# EAGLE design ccnor_stm32_v25-sync-unified-mini (EAGLE 6.1)
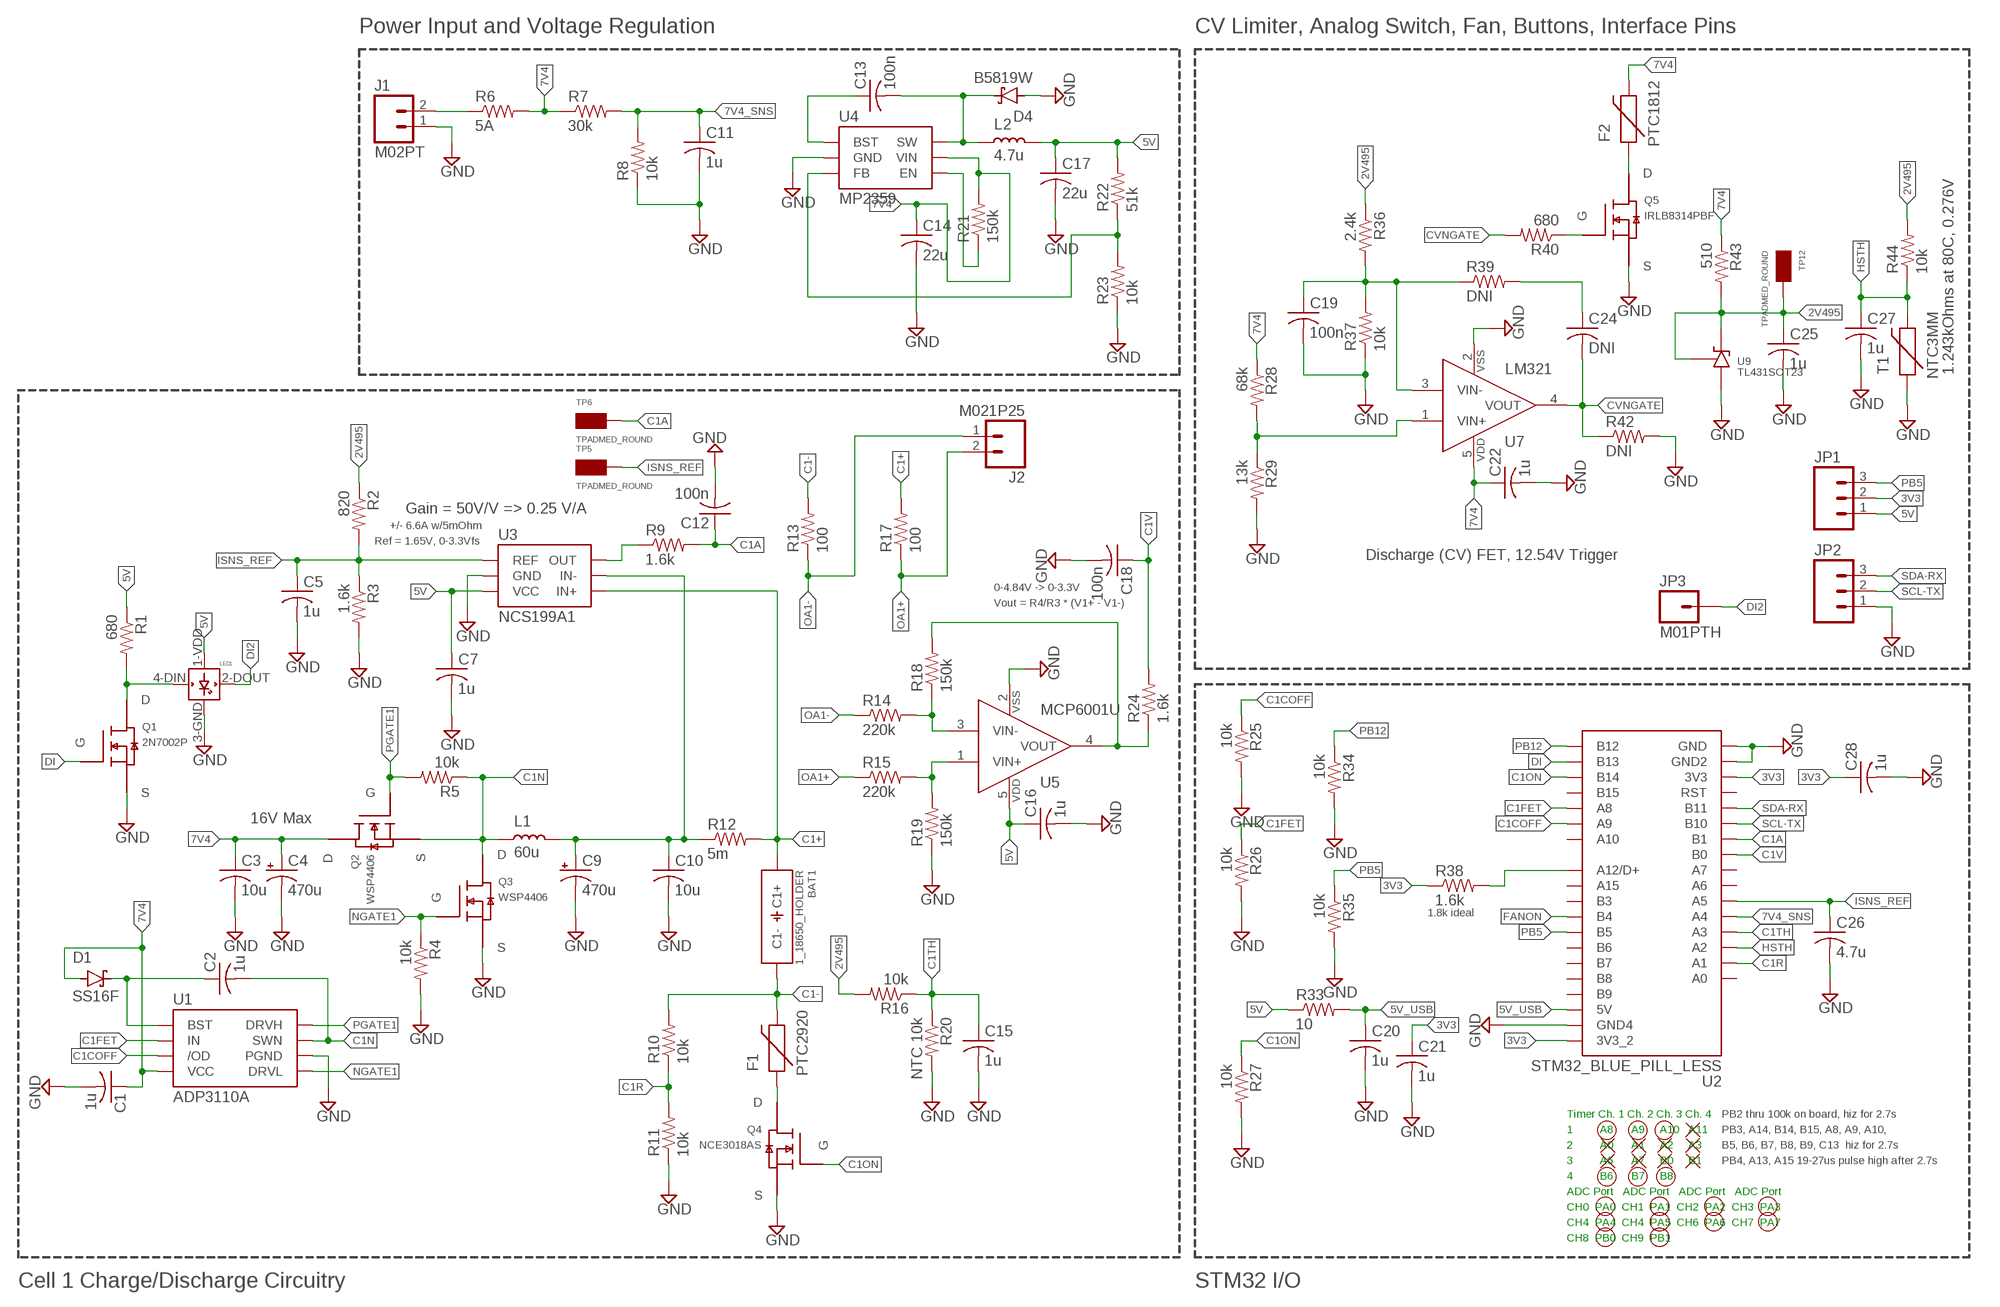
[diagram p0: schematic, sheet 1]

## Parts
BAT1  1_18650_HOLDER  [1S_18650_SMD_NH]
C1  1u  C-USC0402  [C0402]
C2  1u  C-USC0603  [C0603]
C3  10u  C-USC1206  [C1206]
C4  470u  CPOL-USE2.5-7  [E2,5-7]
C5  1u  C-USC0402  [C0402]
C7  1u  C-USC0402  [C0402]
C9  470u  CPOL-USE2.5-7  [E2,5-7]
C10  10u  C-USC1206  [C1206]
C11  1u  C-USC0402  [C0402]
C12  100n  C-USC0402  [C0402]
C13  100n  C-USC0402  [C0402]
C14  22u  C-USC0805  [C0805]
C15  1u  C-USC0402  [C0402]
C16  1u  C-USC0402  [C0402]
C17  22u  C-USC0603  [C0603]
C18  100n  C-USC0402  [C0402]
C19  100n  C-USC0402  [C0402]
C20  1u  C-USC0402  [C0402]
C21  1u  C-USC0402  [C0402]
C22  1u  C-USC0402  [C0402]
C24  DNI  C-USC0402  [C0402]
C25  1u  C-USC0402  [C0402]
C26  4.7u  C-USC0402  [C0402]
C27  1u  C-USC0402  [C0402]
C28  1u  C-USC0402  [C0402]
D1  SS16F  DIODE_SCHOTTKYCDBM140-G  [SOD123]
D4  B5819W  PMEG3020ER  [SOD123W]
F1  PTC2920  [2920]
F2  PTC1812  [1812]
J1  M02PT  [PHOENIXCONTACT1935161]
J2  M021P25  [M02_1P25MM]
JP1  M03PTH  [1X03]
JP2  M03PTH  [1X03]
JP3  M01PTH  [1X01]
L1  60u  INDUCTOR10A  [INDUCTOR_10A_8.2MMX21MM]
L2  4.7u  INDUCTOR0805  [0805]
LED1  WS2812B  [WS2812B]
Q1  2N7002P  [SOT23]
Q2  WSP4406  N-MOSFET-SOIC8  [8-SOIC]
Q3  WSP4406  N-MOSFET-SOIC8  [8-SOIC]
Q4  NCE3018AS  N-MOSFET-SOIC8  [8-SOIC]
Q5  IRLB8314PBF  [TO-220]
R1  680  R-US_R0402  [R0402]
R2  820  R-US_R0402  [R0402]
R3  1.6k  R-US_R0402  [R0402]
R4  10k  R-US_R0402  [R0402]
R5  10k  R-US_R0402  [R0402]
R6  5A  R-US_R1206  [R1206]
R7  30k  R-US_R0402  [R0402]
R8  10k  R-US_R0402  [R0402]
R9  1.6k  R-US_R0402  [R0402]
R10  10k  R-US_R0402  [R0402]
R11  10k  R-US_R0402  [R0402]
R12  5m  R-US_R1206  [R1206]
R13  100  R-US_R0402  [R0402]
R14  220k  R-US_R0402  [R0402]
R15  220k  R-US_R0402  [R0402]
R16  10k  R-US_R0402  [R0402]
R17  100  R-US_R0402  [R0402]
R18  150k  R-US_R0402  [R0402]
R19  150k  R-US_R0402  [R0402]
R20  NTC 10k  R-US_R0402  [R0402]
R21  150k  R-US_R0402  [R0402]
R22  51k  R-US_R0402  [R0402]
R23  10k  R-US_R0402  [R0402]
R24  1.6k  R-US_R0402  [R0402]
R25  10k  R-US_R0402  [R0402]
R26  10k  R-US_R0402  [R0402]
R27  10k  R-US_R0402  [R0402]
R28  68k  R-US_R0402  [R0402]
R29  13k  R-US_R0402  [R0402]
R33  10  R-US_R0402  [R0402]
R34  10k  R-US_R0402  [R0402]
R35  10k  R-US_R0402  [R0402]
R36  2.4k  R-US_R0402  [R0402]
R37  10k  R-US_R0402  [R0402]
R38  1.6k  R-US_R0402  [R0402]
R39  DNI  R-US_R0402  [R0402]
R40  680  R-US_R0402  [R0402]
R42  DNI  R-US_R0402  [R0402]
R43  510  R-US_R0402  [R0402]
R44  10k  R-US_R0402  [R0402]
T1  NTC3MM  PTCNTC3MM  [THERMISTOR_3MMX3MM]
TP5  TPADMED_ROUND  [TPAD_MED_ROUND]
TP6  TPADMED_ROUND  [TPAD_MED_ROUND]
TP12  TPADMED_ROUND  [TPAD_MED_ROUND]
U1  ADP3110A  [8-SOIC]
U2  STM32_BLUE_PILL_LESS  [STM32_BLUE_PILL_SMD]
U3  NCS199A1  INA214  [SOT-363]
U4  MP2359  JW5052C  [SOT23-6]
U5  MCP6001U  [SOT23-5]
U7  LM321  [SOT23-5]
U9  TL431SOT23  [SOT23]

## Nets
2V495: C25.1 R2.1 R16.2 R36.1 R43.2 R44.2 TP12.1 U9.1(K) U9.2(REF)
3V3: C21.1 C28.1 JP1.2 R38.1 U2.3V3 U2.3V3_2
5V: C7.1 C16.1 C17.1 JP1.1 L2.2 LED1.1-VDD(VDD) R1.1 R22.2 R33.1 U3.3(VCC) U5.5(VDD)
5V_USB: C20.1 R33.2 U2.5V
7V4: C1.1 C3.1 C4.+ C14.1 C22.1 D1.A(ANODE) F2.2 Q2.5(D) Q2.6(D) Q2.7(D) Q2.8(D) R6.2 R7.1 R21.2 R28.1 R43.1 U1.4(VCC) U4.5(VIN) U7.5(VDD)
7V4_SNS: C11.1 R7.2 R8.2 U2.A4
BST: C2.1 D1.K(CATHODE) U1.1(BST)
BST5V: C13.1 U4.1(BST)
C1+: BAT1.1+(C1+) R12.2 R17.2 U3.4(IN+)
C1-: BAT1.1-(C1-) F1.K R10.2 R13.2
C1A: C12.1 R9.2 TP6.1 U2.B1
C1COFF: R25.1 U1.3(/OD) U2.A9
C1FET: R26.1 U1.2(IN) U2.A8
C1N: C2.2 L1.P$1 Q2.1(S) Q2.2(S) Q2.3(S) Q3.5(D) Q3.6(D) Q3.7(D) Q3.8(D) R5.1 U1.7(SWN)
C1ON: Q4.4(G) R27.1 U2.B14
C1R: R10.1 R11.2 U2.A1
C1TH: C15.1 R16.1 R20.1 U2.A3
C1V: C18.1 R24.2 U2.B0
C1V_OA: R18.2 R24.1 U5.4(VOUT)
C1VFBN: C24.1 R39.2
CVNGATE: C24.2 R40.2 R42.1 U7.4(VOUT)
CVOAREF: C19.1 R36.2 R37.2 R39.1 U7.3(VIN-)
CVOASNS: R28.2 R29.1 U7.1(VIN+)
DI: Q1.1(G) U2.B13
DI1: LED1.4-DIN(DIN) Q1.3(D) R1.2
DI2: JP3.1 LED1.2-DOUT(DOUT)
EN5V: R21.1 U4.4(EN)
FANON: U2.B4
FB5V: R22.1 R23.2 U4.3(FB)
GND: C1.2 C3.2 C4.- C5.2 C7.2 C9.- C10.2 C11.2 C12.2 C14.2 C15.2 C16.2 C17.2 C18.2 C19.2 C20.2 C21.2 C22.2 C25.2 C26.2 C27.2 C28.2 D4.A(ANODE) J1.1 JP2.1 LED1.3-GND(GND) Q1.2(S) Q3.1(S) Q3.2(S) Q3.3(S) Q4.1(S) Q4.2(S) Q4.3(S) Q5.3(S) R3.2 R4.2 R8.1 R11.1 R19.1 R20.2 R23.1 R25.2 R26.2 R27.2 R29.2 R34.2 R35.2 R37.1 R42.2 T1.1 U1.6(PGND) U2.GND U2.GND2 U2.GND4 U3.2(GND) U4.2(GND) U5.2(VSS) U7.2(VSS) U9.3(A)
HSTH: C27.1 R44.1 T1.2 U2.A2
IN-1: C9.+ C10.1 L1.P$2 R12.1 U3.5(IN-)
IS1O: R9.1 U3.6(OUT)
ISNS_REF: C5.1 C26.1 R2.2 R3.1 TP5.1 U2.A5 U3.1(REF)
N$3: R15.2 R19.2 U5.1(VIN+)
N$4: R14.2 R18.1 U5.3(VIN-)
N$10: F2.1 Q5.2(D)
N$13: J1.2 R6.1
N$26: R38.2 U2.A12(A12/D+)
N$32: F1.A Q4.5(D) Q4.6(D) Q4.7(D) Q4.8(D)
NGATE1: Q3.4(G) R4.1 U1.5(DRVL)
OA1+: J2.2 R15.1 R17.1
OA1-: J2.1 R13.1 R14.1
PB5: JP1.3 R35.1 U2.B5
PB12: R34.1 U2.B12
PGATE1: Q2.4(G) R5.2 U1.8(DRVH)
Q7G: Q5.1(G) R40.1
SCL-TX: JP2.2 U2.B10
SDA-RX: JP2.3 U2.B11
SW5V: C13.2 D4.K(CATHODE) L2.1 U4.6(SW)
Unconnected: U2.A0 U2.A6 U2.A7 U2.A10 U2.A15 U2.B3 U2.B6 U2.B7 U2.B8 U2.B9 U2.B15 U2.RST

## Notes on the sheet
- Power Input and Voltage Regulation | CV Limiter, Analog Switch, Fan, Buttons, Interface Pins
- 1.243kOhms at 80C, 0.276V
- Gain = 50V/V => 0.25 V/A
- +/- 6.6A w/5mOhm
- Ref = 1.65V, 0-3.3Vfs
- Discharge (CV) FET, 12.54V Trigger
- 0-4.84V -> 0-3.3V
- Vout = R4/R3 * (V1+ - V1-)
- 16V Max
- 1.8k ideal
- Timer Ch. 1 Ch. 2 Ch. 3 Ch. 4 | PB2 thru 100k on board, hiz for 2.7s
- 1         A8      A9     A10   A11 | PB3, A14, B14, B15, A8, A9, A10,
- 2         A0      A1     A2     A3 | B5, B6, B7, B8, B9, C13  hiz for 2.7s
- 3         A6      A7     B0     B1 | PB4, A13, A15 19-27us pulse high after 2.7s
- 4         B6      B7     B8
- ADC Port   ADC Port   ADC Port   ADC Port
- CH0  PA0  CH1  PA1  CH2  PA2  CH3  PA3
- CH4  PA4  CH4  PA5  CH6  PA6  CH7  PA7
- CH8  PB0  CH9  PB1
- Cell 1 Charge/Discharge Circuitry | STM32 I/O

## Library data of the parts
BAT1 = custom:1_18650_HOLDER
C1-C3 C5 C7 C10-C22 C24-C28 = resistor:C-US: CAPACITOR, American symbol
C4 C9 = resistor:CPOL-US: POLARIZED CAPACITOR, American symbol
D1 = custom:DIODE_SCHOTTKY: 40V 1A 500mV @1A
D4 = custom:PMEG3020ER: Schottky Diode 30V 2A 0.42V 1.5mA Leakage
F1 F2 T1 = custom:PTC
J1 J2 = custom:M02: 2-pin Header
JP1 JP2 = SparkFun:M03: Header 3 Standard 3-pin 0.1" header. Use with straight break away headers (SKU : PRT-00116), right angle break away headers (PRT-00553), swiss pins (PRT-00743), machine pins (PRT-00117), and female headers (PRT-00115). Molex polarized connector foot print use with SKU : PRT-08232 with associated crimp pins and housings.
JP3 = SparkFun:M01: Header 1 Standard 1-pin 0.1" header. Use with straight break away headers (SKU : PRT-00116), right angle break away headers (PRT-00553), swiss pins (PRT-00743), machine pins (PRT-00117), and female headers (PRT-00115).
L1 L2 = custom:INDUCTOR
LED1 = adafruit:WS2812B
Q1 = custom:2N7002P: 2N7002P N-channel MOSFET 60V 360mA Logic Level
Q2-Q4 = custom:N-MOSFET-SOIC8
Q5 = custom:IRLB8314PBF: MOSFET N-Channel 30V 184A 3.2mOhm @4.5Vgs 125W
R1-R29 R33-R40 R42-R44 = resistor:R-US_: RESISTOR, American symbol
TP5 TP6 TP12 = custom:TPAD
U1 = custom:ADP3110A: MOSFET Driver Dual Bootstrapped 12 V w/Output Disable 3nF 25ns Synchronous
U2 = custom:STM32_BLUE_PILL_LESS
U3 = custom:INA214: Current Shunt Amplifier 30kHz 2.7-26V
U4 = custom:JW5052C: Buck Regulator Synchronous 4.5-18V 2A 700kHz 100uA 120mOhm
U5 = custom:MCP6001: Op-Amp Single Rail-to-Rail 1MHz
U7 = custom:LM321: Op-Amp Low Power Single 3-32V Vcm 0-(Vcc-1.5) Vo 0.02-(Vcc-2)
U9 = custom:TL431: Shunt Voltage Reference IC 700uA 100mA 36V

## Board
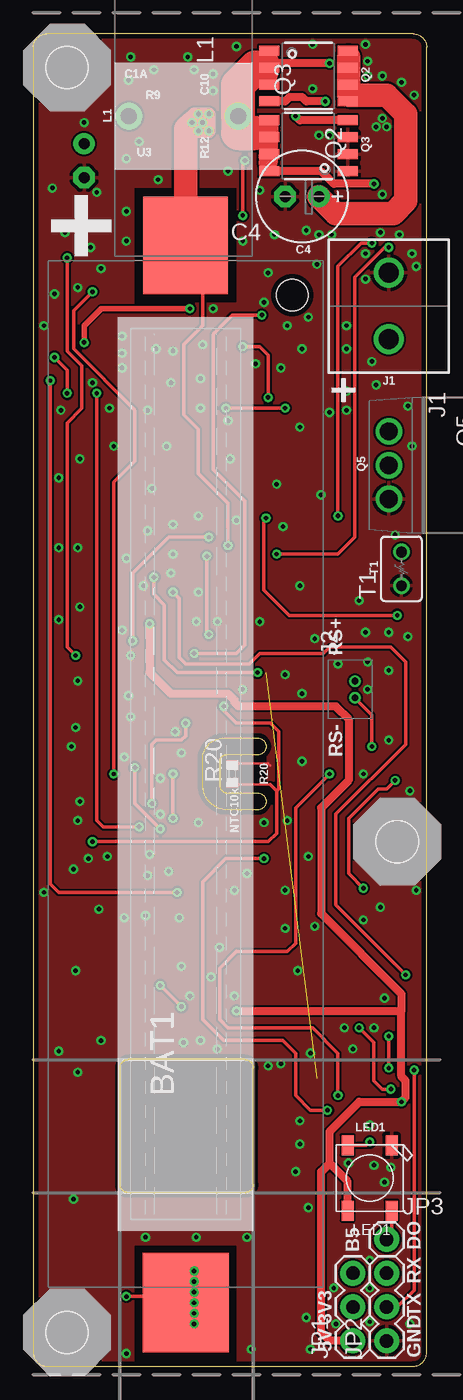
[diagram p1: board, top side]
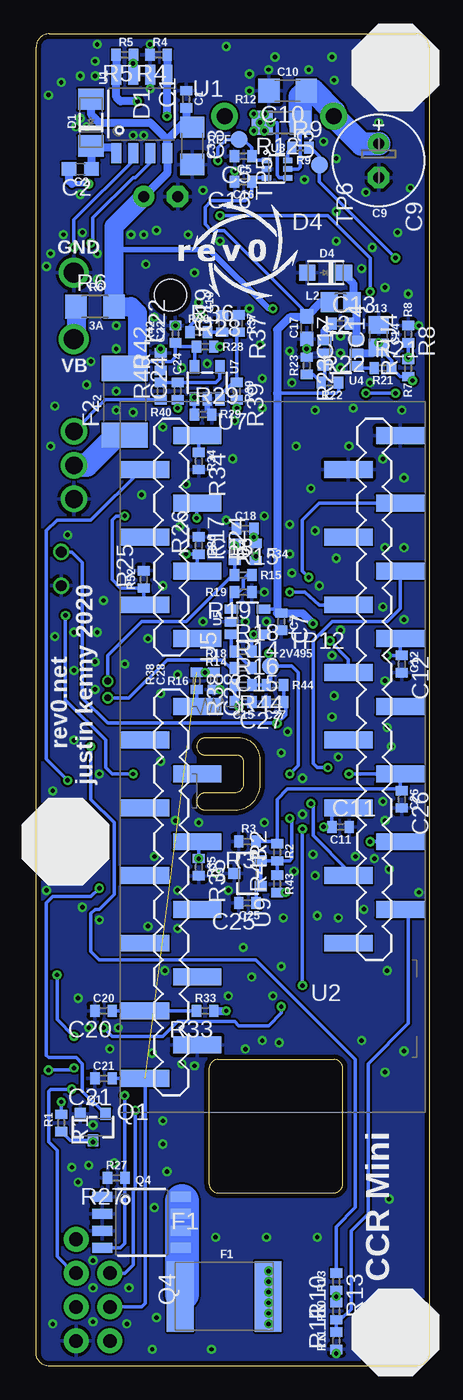
[diagram p2: board, bottom side, seen from below]

Size 29.52 x 100 mm. Coordinates in mm from the lower left corner, seen from the top.
Outline: 1,0 28.52,0 arc90 29.52,1 29.52,99 arc90 28.52,100 1,100 arc90 0,99 0,1 arc90 1,0
Outline: 16.83,45.88 14.45,45.88 arc90 13.97,45.4 13.97,43.66 arc90 14.61,43.02 16.83,43.02 arc-180 16.83,41.75 14.61,41.75 arc-90 12.7,43.66 12.7,45.56 arc-90 14.29,47.15 16.83,47.15 arc-180 16.83,45.88
Outline: 6.51,13.65 6.51,22.38 arc-90 7.14,23.02 15.88,23.02 arc-90 16.51,22.38 16.51,13.65 arc-90 15.88,13.02 7.14,13.02 arc-90 6.51,13.65
Copper layers (1*16): Top 0.0356mm / dielectric 1.5011mm / Bottom 0.0356mm
Design rules: minimum track width 6mil, minimum drill 13mil, track to track 6mil, track to pad 6mil, pad to pad 6mil, via to via 6mil, smd to smd 6mil, copper to edge 15mil, drill to drill 6mil, minimum pad ring 7mil, minimum via ring 7mil, stop-mask expansion 2.5mil, vias tented up to drill 14mil, thermal gap 10mil
Holes 3.17 mm at 2.54,2.54 2.54,97.47 27.3,39.37
tRestrict: area -0.6,94.3 to 5.7,100.6; area -0.6,-0.6 to 5.7,5.7; area 14,43 to 17.5,45.7; area 7.6,0.5 to 15.2,9; area 7.6,79.9 to 15.2,88.4; area 24.1,36.2 to 30.5,42.5
bRestrict: area 14,42.5 to 17.5,46.4; area -0.6,-0.6 to 5.7,5.7; area -0.6,94.3 to 5.7,100.6; area 24.1,36.2 to 30.5,42.5

### Footprints (pad centres in the part's own frame; a part is rotated, then mirrored left to right if it is on the bottom)
1S_18650_SMD_NH = smd 7.341 x 6.35: 1+ 39.67,0 | smd 7.46 x 6.47: 1- -39.67,0 | hole 2.39: 35.93,-8
C0402 = smd 0.7 x 0.9: 1 -0.65,0; 2 0.65,0
C0603 = smd 1.1 x 1: 1 -0.85,0; 2 0.85,0
C1206 = smd 1.6 x 1.8: 1 -1.4,0; 2 1.4,0
E2,5-7 = drill 0.813 pad 1.6: + -1.27,0 | drill 0.813 pad 1.6 octagon: - 1.27,0
C0805 = smd 1.3 x 1.5: 1 -0.85,0; 2 0.85,0
SOD123 = smd 1.6 x 1.9: A -1.75,0; K 1.75,0
SOD123W = smd 1.2 x 1.2: A -1.4,0; K 1.4,0
2920 = smd 2 x 5.3: A -3.3,0; K 3.3,0
1812 = smd 1.9 x 3.45: 1 -2.5,0; 2 2.5,0
PHOENIXCONTACT1935161 = drill 1.5: 1 0,0; 2 5,0
M02_1P25MM = drill 0.5: 1 -0.625,0; 2 0.625,0
1X03 = drill 1.016 pad 1.88: 1 0,0; 2 2.54,0; 3 5.08,0
1X01 = drill 1.016 pad 1.88: 1 0,0
INDUCTOR_10A_8.2MMX21MM = drill 1.2 pad 2: P$1 0,4.1; P$2 0,-4.1
0805 = smd 1.3 x 1.5: 1 -0.85,0; 2 0.85,0
WS2812B = smd 1.5 x 0.9: 1-VDD 2.45,-1.65; 2-DOUT 2.45,1.65; 3-GND -2.45,1.65; 4-DIN -2.45,-1.65
SOT23 = smd 0.8 x 0.9: 1 0.95,1; 2 -0.95,1; 3 0,-1
8-SOIC = smd 0.75 x 1.5: 1 -1.905,-2.95; 2 -0.635,-2.95; 3 0.635,-2.95; 4 1.905,-2.95; 5 1.905,2.95; 6 0.635,2.95; 7 -0.635,2.95; 8 -1.905,2.95
TO-220 = drill 1.325: 1 -2.54,0; 2 0,0; 3 2.54,0
R0402 = smd 0.7 x 0.9: 1 -0.65,0; 2 0.65,0
R1206 = smd 1.6 x 1.803: 1 -1.422,0; 2 1.422,0
THERMISTOR_3MMX3MM = drill 0.813: 1 -1.27,0; 2 1.27,0
TPAD_MED_ROUND = smd 1.27 x 1.27: 1 0,0
STM32_BLUE_PILL_SMD = smd 3.607 x 1.27: 3V3 -9.563,-19.05; 3V3_2 9.563,24.13; 5V 9.563,19.05; A0 -5.677,13.97; A1 -9.563,11.43; A2 -5.677,8.89; A3 -9.563,6.35; A4 -5.677,3.81; A5 -9.563,1.27; A6 -5.677,-1.27; A7 -9.563,-3.81; A8 5.677,-13.97; A9 9.563,-11.43; A10 5.677,-8.89; A12 5.677,-3.81; A15 9.563,-1.27; B0 -5.677,-6.35; B1 -9.563,-8.89; B3 5.677,1.27; B4 9.563,3.81; B5 5.677,6.35; B6 9.563,8.89; B7 5.677,11.43; B8 9.563,13.97; B9 5.677,16.51; B10 -5.677,-11.43; B11 -9.563,-13.97; B12 5.677,-24.13; B13 9.563,-21.59; B14 5.677,-19.05; B15 9.563,-16.51; GND -9.563,-24.13; GND2 -5.677,-21.59; GND4 5.677,21.59; RST -5.677,-16.51
SOT-363 = smd 0.42 x 0.7: 1 -0.65,-0.8; 2 0,-0.8; 3 0.65,-0.8; 4 0.65,0.8; 5 0,0.8; 6 -0.65,0.8
SOT23-6 = smd 0.7 x 1: 1 -0.95,-1.2; 2 0,-1.2; 3 0.95,-1.2; 4 0.95,1.2; 5 0,1.2; 6 -0.95,1.2
SOT23-5 = smd 0.7 x 1: 1 0.95,1.2; 2 0,1.2; 3 -0.95,1.2; 4 -0.95,-1.2; 5 0.95,-1.2

### Placement (x,y rotation side)
BAT1  11.43,44.45 90 top
C1  18.26,95.09 90 bottom
C2  26.19,89.85 180 bottom
C3  17.78,91.6 270 bottom
C4  20.16,87.79 180 top
C5  13.97,90.81 180 bottom
C7  11.11,55.88 270 bottom
C9  3.81,90.49 270 bottom
C10  10.64,95.73 180 bottom
C11  6.67,40.48 0 bottom
C12  2.06,52.7 270 bottom
C13  6.67,78.26 0 bottom
C14  3.81,77.31 90 bottom
C15  13.97,49.85 0 bottom
C16  13.97,88.9 180 bottom
C17  9.21,77.95 270 bottom
C18  13.81,62.87 180 bottom
C19  15.56,78.26 90 bottom
C20  24.45,26.67 180 bottom
C21  24.45,21.59 180 bottom
C22  19.05,77.47 90 bottom
C24  18.89,73.18 90 bottom
C25  13.65,34.77 180 bottom
C26  2.06,42.55 270 bottom
C27  11.59,49.85 180 bottom
C28  16.19,51.44 270 bottom
D1  25.4,93.34 270 bottom
D4  7.78,82.07 0 bottom
F1  15.4,5.24 0 bottom
F2  22.86,72.39 90 bottom
J1  26.67,82.07 270 top
J2  24.13,50.8 90 top
JP1  23.97,1.91 90 top
JP2  26.51,1.91 90 top
JP3  26.51,9.53 0 top
L1  11.27,93.82 270 top
L2  6.67,79.85 180 bottom
LED1  25.24,14.13 270 top
Q1  25.24,17.94 0 bottom
Q2  20.64,96.84 270 top
Q3  20.64,91.6 90 top
Q4  21.59,10.79 270 bottom
Q5  26.67,67.63 270 top
R1  27.62,18.26 270 bottom
R2  11.43,38.58 90 bottom
R3  13.65,39.37 180 bottom
R4  20.32,98.42 180 bottom
R5  22.86,98.42 180 bottom
R6  25.08,79.53 0 bottom
R7  1.59,74.93 90 bottom
R8  1.59,77.47 270 bottom
R9  9.68,91.44 0 bottom
R10  6.99,4.13 90 bottom
R11  6.99,1.91 90 bottom
R12  11.11,93.34 180 bottom
R13  6.99,6.35 270 bottom
R14  13.97,52.39 0 bottom
R15  13.97,59.37 0 bottom
R16  13.97,51.12 0 bottom
R17  14.61,61.12 90 bottom
R18  13.97,53.66 0 bottom
R19  13.97,58.1 180 bottom
R20  14.92,44.45 90 top
R21  3.49,74.93 0 bottom
R22  7.46,73.82 0 bottom
R23  9.21,75.09 270 bottom
R24  13.02,61.12 90 bottom
R25  21.43,59.05 90 bottom
R26  17.3,61.59 90 bottom
R27  23.5,14.13 180 bottom
R28  16.83,76.52 0 bottom
R29  16.99,71.44 0 bottom
R33  16.83,26.67 180 bottom
R34  17.3,67.94 270 bottom
R35  17.3,37.47 270 bottom
R36  17.3,77.63 0 bottom
R37  14.29,78.26 270 bottom
R38  17.46,51.44 270 bottom
R39  14.45,73.18 270 bottom
R40  20.16,73.18 90 bottom
R42  20.16,75.41 90 bottom
R43  11.43,36.2 90 bottom
R44  11.59,51.12 180 bottom
T1  27.62,59.85 90 top
TP5  14.29,92.08 270 bottom
TP6  8.26,90.17 270 bottom
TP12  11.91,52.55 0 bottom
U1  21.59,93.98 0 bottom
U2  11.75,45.72 180 bottom
U3  11.43,89.85 270 bottom
U4  6.67,76.04 270 bottom
U5  13.65,55.88 90 bottom
U7  16.67,73.82 180 bottom
U9  13.65,36.99 270 bottom

### Tracks (layer width: path | path; a pad name or v marks a point on that pad's centre or on a via)
2V495  (via drill 0.33)
  Top 0.254: v10.48,44.45 v10.48,41.12 | v17.14,78.9 14.92,78.9 13.49,77.47 13.49,67.31 15.88,64.93 15.88,54.13 15.24,53.5 v12.06,53.5
  Bottom 0.254: R2.1 11.44,37.94 U9.2 U9.1 13,35.69 C25.1 | R43.2 R2.1 | R16.2 R44.2 11.91,51.45 TP12.1 | TP12.1 10.32,52.55 9.84,52.07 9.84,45.09 v10.48,44.45 | v10.48,41.12 10.32,40.96 10.32,38.1 10.49,37.93 R2.1 | R36.1 17.95,78.09 v17.14,78.9 | v12.06,53.5 12.06,52.7 TP12.1
3V3  (via drill 0.33)  (1 unrouted)
  Top 0.254: v16.83,52.07 10.79,52.07 9.84,53.02 9.84,57.15 9.05,57.94 v9.05,59.21
  Bottom 0.254: C28.1 R38.1 16.84,52.09 v16.83,52.07 | C21.1 U2.3V3_2 21.31,4.72 21.59,4.45 JP1.2 | U2.3V3 8.26,64.77 9.53,63.5 9.53,59.69 v9.05,59.21
5V  (via drill 0.33)
  Top 0.61: 27.62,26.67 27.62,27.94 21.59,33.97 21.59,41.91 23.65,43.97 23.65,48.58 22.7,49.53 15.4,49.53 15.08,49.85 15.08,50.01 14.61,50.48 10.32,50.48 8.73,52.07 v8.73,55.72 | LED1.1-VDD 23.59,13.87 22.23,15.24 | 22.23,15.24 22.23,17.62 24.45,19.84 v27.62,19.84 27.94,20.16 27.94,21.43 27.62,21.75 27.62,26.67 | v15.24,26.67 27.62,26.67 | JP1.1 22.23,1.91 21.59,2.54 21.59,14.61 22.23,15.24
  Bottom 0.254: U3.3 13.03,89.2 13.34,88.9 C16.1 13.32,88.76 13.34,88.74 13.34,87.95 13.81,87.47 16.35,87.47 16.83,87 16.83,85.72 16.35,85.25 15.4,85.25 9.53,79.38 9.53,79.11 C17.1 9.26,78.74 | R22.2 6.81,73.2 6.99,73.03 11.43,73.03 | U5.5 11.41,56.83 | 11.41,56.83 C7.1 | R1.1 v27.62,19.84 | 11.41,56.83 11.41,56.53 11.43,56.52
  Bottom 0.61: L2.2 8.15,79.85 C17.1 | 9.26,78.74 10.48,78.74 11.43,77.79 11.43,73.03 11.43,56.52 9.53,56.52 v8.73,55.72 | R33.1 v15.24,26.67
5V_USB
  Bottom 0.254: R33.2 U2.5V C20.1
7V4  (via drill 0.33)
  Top 0.254: 23.65,95.41 23.65,96.14 Q2.6 | Q2.7 Q2.8 | 23.65,98.58 23.65,98.27 | v10.79,35.56 1.91,35.56 1.27,36.2 v1.27,73.98
  Top 0.406: v3.81,76.83 3.81,78.11 5.08,79.38 v11.75,79.38
  Top 0.61: Q2.8 23.59,98.65 23.65,98.58 | Q2.5 23.59,95.03 23.65,95.41
  Top 1.778: 23.65,98.27 23.65,95.41 26.51,95.41 27.94,93.98 27.94,87.47 26.99,86.52 22.7,86.52 C4.+
  Bottom 0.254: 22.23,74.89 21.71,75.41 19.37,75.41 19.05,75.72 C22.1 18.75,76.52 R28.1 17.62,76.38 U7.5 | R43.1 10.81,35.55 v10.79,35.56 | v1.27,73.98 R7.1 2.19,74.28 R21.2 2.84,75.49 C14.1 4.23,76.04 | 23.66,85.56 23.66,83.99 23.5,83.82
  Bottom 0.406: C14.1 v3.81,76.83 | v11.75,79.38 12.06,79.38 16.51,83.82 23.5,83.82
  Bottom 0.61: C4.+ 19.68,89.53 U1.4 19.68,92.08 | C1.1 18.26,93.47 | 18.26,93.47 C3.1 | 18.26,93.47 18.29,93.47 19.68,92.08 | D1.A 25.4,93.98 24.77,93.34 20.95,93.34 19.68,92.08 | U4.5 4.23,76.04
  Bottom 1.422: C4.+ 23.66,85.56 R6.2 22.38,79.53 21.91,79.06 21.91,75.09 22.11,74.89 22.23,74.89 F2.2
7V4_SNS  (via drill 0.33)
  Top 0.254: v7.94,40.48 5.24,40.48 4.76,40.96 v4.76,73.03 | v2.54,73.03 2.54,74.77 v1.59,75.72
  Bottom 0.254: U2.A4 6.99,41.91 7.32,41.58 C11.1 v7.94,40.48 | R7.2 v1.59,75.72 R8.2 | v4.76,73.03 v2.54,73.03
BST
  Bottom 0.61: C2.1 25.34,91.54 D1.K 25.25,91.44 23.5,91.44 U1.1
BST5V
  Bottom 0.61: U4.1 7.87,77.71 C13.1
C1+  (via drill 0.33)
  Top 0.254: v14.61,61.59 14.61,64.77 12.38,66.99 12.38,70.33 11.27,71.44 11.27,76.68 12.7,78.11 12.7,82.85 BAT1.1+
  Top 1.016: v12.38,93.98 v13.18,93.98 v13.18,92.71 12.7,92.71 | 11.91,93.82 12.06,93.98 v12.38,93.98 | v12.38,92.71 12.7,92.71 | v12.38,93.98 11.91,93.5 v11.91,93.34 12.06,93.34 12.7,92.71 | 12.7,92.71 v12.7,93.34
  Top 1.778: BAT1.1+ 11.43,92.87 v11.91,93.34
  Bottom 0.254: U3.4 11.26,89.2 11.43,89.38 11.43,93.34 v11.91,93.34 | R17.2 v14.61,61.59
  Bottom 1.016: v12.7,93.34 R12.2
C1-  (via drill 0.33)
  Top 0.254: v6.99,5.24 10.97,5.24 BAT1.1-
  Top 1.016: v12.06,4.76 11.45,4.76 BAT1.1-
  Bottom 0.254: R13.2 v6.99,5.24 R10.2
  Bottom 1.016: F1.K 12.1,6.95 v12.06,7.14 v12.06,6.35 v12.06,5.56 v12.06,4.76 v12.06,3.97 v12.06,3.17
C1A  (via drill 0.33)
  Top 0.254: v3.17,53.34 2.54,53.98 2.54,70.8 3.65,71.91 3.65,75.09 2.54,76.2 v2.54,83.19
  Bottom 0.254: R9.2 8.89,91.44 8.26,90.81 TP6.1 8.26,88.9 v2.54,83.19 | v3.17,53.34 2.08,53.34 C12.1 2.18,53.48 U2.B1
C1COFF  (via drill 0.33)
  Top 0.254: v25.4,84.3 24.61,84.3 22.86,82.55 v22.86,63.82
  Bottom 0.254: U1.3 20.95,90.33 22.07,89.22 22.23,89.22 25.24,86.2 25.24,84.45 v25.4,84.3 | v22.86,63.82 23.5,63.82 23.81,63.5 23.81,59.05 23.18,58.42 21.45,58.42 R25.1 21.43,57.27 U2.A9
C1FET  (via drill 0.33)
  Top 0.254: v18.26,60.96 22.86,60.96 24.13,62.23 24.13,81.76 26.35,83.98 v26.67,83.98
  Bottom 0.254: U1.2 22.23,90.49 26.67,86.04 v26.67,83.98 | v18.26,60.96 17.32,60.96 R26.1 17.42,60.82 U2.A8
C1N  (via drill 0.33)
  Top 0.61: Q2.1 Q2.2 | Q2.3 17.69,96.77 17.62,96.84 | 16.67,97.47 Q2.2 | 17.62,90.33 17.69,90.26 Q3.8 21.59,89.69 22.54,88.74 v25.56,88.74 | Q3.7 17.69,90.87 17.62,90.81 | 16.67,92.55 16.99,92.23 Q3.6 17.78,92.33 17.78,92.71 17.69,92.8 Q3.5 | v22.23,97.79 18,97.79 Q2.2
  Top 1.422: Q2.2 17.69,98.04 17.62,98.11 17.62,96.84 | Q3.6 17.69,92.96 17.62,93.03 17.62,90.81 17.62,90.33
  Top 2.54: 16.67,97.47 15.37,96.17 L1.P$1 15.37,92.58 15.4,92.55 16.67,92.55
  Bottom 0.406: v25.56,88.74 26.83,88.74
  Bottom 0.61: U1.7 v22.23,97.79 22.21,97.81 R5.1 | C2.2 27.04,88.96 26.83,88.74
C1ON  (via drill 0.33)
  Top 0.254: v22.86,20.32 22.86,23.5 20.95,25.4 14.61,25.4 13.97,26.04 13.97,29.84 15.24,31.11 19.05,31.11 19.68,31.75 19.68,41.91 v22.23,44.45 | v27.3,56.36 19.21,56.36 17.3,58.26 17.3,63.5 v17.46,63.66
  Bottom 0.254: Q4.4 23.18,8.89 22.86,9.21 22.86,14.11 R27.1 22.84,19.7 v22.86,20.32 | v22.23,44.45 23.81,44.45 24.29,44.93 24.29,46.99 27.3,50.01 v27.3,56.36 | v17.46,63.66 17.46,64.73 U2.B14
C1R
  Bottom 0.254: R11.2 R10.1 6.68,3.48 5.87,4.29 5.87,10.16 4.6,11.43 4.6,22.7 1.59,25.72 1.59,34.33 U2.A1
C1TH  (via drill 0.33)
  Top 0.203: 17.77,43.64 17.78,43.66 15.24,43.66 15.1,43.8 R20.1
  Top 0.254: 17.78,43.66 18.26,43.18 | 18.26,43.18 18.26,40.01 17.62,39.37 v4.45,39.37 | v14.29,49.53 14.29,49.21 15.24,48.26 17.78,48.26 18.41,47.62 18.41,43.34 18.26,43.18
  Bottom 0.254: v4.45,39.37 U2.A3 | R16.1 C15.1 14.61,49.85 v14.29,49.53
C1V  (via drill 0.33)
  Top 0.254: v7.46,54.45 7.46,59.53 10.16,62.23 v13.18,62.23
  Bottom 0.254: C18.1 13.16,62.22 | R24.2 13.16,61.91 13.16,62.22 | U2.B0 6.07,53.06 v7.46,54.45 | 13.16,62.22 v13.18,62.23
C1V_OA  (via drill 0.33)
  Top 0.254: v13.02,60.8 13.02,55.09 v13.18,54.93
  Bottom 0.254: R24.1 v13.02,60.8 | U5.4 v13.18,54.93 13.32,54.78 R18.2
C1VFBN  (via drill 0.33)
  Top 0.254: v18.89,71.91 v14.45,71.91
  Bottom 0.254: C24.1 v18.89,71.91 | v14.45,71.91 R39.2
CVNGATE
  Bottom 0.254: U7.4 15.72,74.13 16.03,73.82 C24.2 | C24.2 R40.2 R42.1 | C24.2
CVOAREF
  Bottom 0.254: U7.3 15.72,72.86 14.75,73.83 R39.1 14.45,77.45 R37.2 C19.1 15.57,77.63 R36.2
CVOASNS  (via drill 0.33)
  Top 0.254: v15.72,76.52 16.99,76.52 17.62,75.88 v17.62,72.71
  Bottom 0.254: R29.1 17.64,72.6 U7.1 17.78,72.46 17.78,72.39 17.62,72.55 v17.62,72.71 | R28.2 v15.72,76.52
DI  (via drill 0.33)
  Top 0.254: v24.77,35.88 23.65,36.99 23.65,41.12 25.88,43.34 26.51,43.34 v27.15,43.97
  Bottom 0.254: U2.B13 21.59,67.31 25.4,63.5 27.94,63.5 28.73,62.71 28.73,45.56 v27.15,43.97 | Q1.1 24.29,18.89 26.04,20.64 26.04,22.7 26.51,23.18 28.57,23.18 28.73,23.34 28.73,34.77 28.26,35.24 25.4,35.24 v24.77,35.88
DI1  (via drill 0.33)
  Top 0.254: LED1.4-DIN 24.99,16.58 v25.24,16.83
  Bottom 0.254: R1.2 26.95,16.94 Q1.3 v25.24,16.83
DI2
  Top 0.254: LED1.2-DOUT 26.89,9.9 JP3.1
EN5V
  Bottom 0.254: R21.1 5.31,74.93 U4.4
FB5V
  Bottom 0.254: U4.3 7.87,74.06 R22.1 8.73,74.44 R23.2
GND  (via drill 0.33)
  Top 0.203: R20.2 15.1,45.1 15.24,45.24 17.62,45.24 17.78,45.09
  Bottom 0.406: U7.2 16.67,71.77 R29.2
  other vias: 26.19,87.95 26.51,93.03 25.72,93.03 22.23,92.39 21.43,92.39 20.95,95.89 20.95,99.22 24.92,99.22 25.08,96.84 25.08,97.95 26.19,96.84 27.62,96.36 28.57,95.41 26.19,93.66 24.92,83.5 27.46,84.93 22.38,84.93 23.5,78.11 23.5,76.36 9.21,76.36 6.67,76.04 6.03,69.06 3.33,22.07 5.08,24.45 22.86,52.7 7.3,53.34 15.72,50.8 14.61,89.69 20.8,23.5 23.34,25.4 23.97,23.81 25.56,25.4 26.35,27.62 15.08,27.78 19.84,29.69 21.11,33.02 24.77,33.5 26.04,34.45 28.73,35.72 18.89,35.72 18.89,32.86 13.34,29.21 11.75,27.78 11.11,30 13.97,31.43 15.08,35.72 16.03,36.99 20.64,38.26 19.05,40.96 17.3,40.8 12.38,40.8 10.16,37.15 8.73,38.42 9.53,41.43 9.53,44.13 6.83,45.72 3.49,42.39 5.56,38.26 0.79,35.56 4.92,34.29 3.17,29.69 1.91,23.65 3.02,12.54 8.41,9.68 16.03,9.68 19.68,14.61 26.35,13.81 25.56,15.08 26.83,14.92 25.24,18.1 23.65,15.24 25.24,5.87 25.24,7.94 25.24,3.33 22.7,3.17 22.54,5.87 20.8,1.27 28.26,3.17 20.48,3.65 20.64,11.91 20,16.67 6.99,0.95 12.22,9.68 16.35,1.27 20,18.41 17.62,22.54 18.57,22.7 13.81,23.81 12.54,24.45 11.27,24.29 10.95,33.66 8.41,33.81 6.83,33.66 8.57,36.83 3.02,37.31 4.13,38.1 3.33,40.96 2.86,46.51 3.17,47.94 7.3,48.74 7.14,50.32 10.64,47.62 11.11,46.04 20.16,45.4 28.26,43.18 26.67,46.99 24.77,44.45 20.16,50.48 18.89,51.91 25.08,52.86 25.08,50.8 26.67,52.23 26.67,55.09 24.92,55.09 21.11,54.61 28.1,54.77 24.45,57.47 20,58.58 16.99,55.88 13.81,55.88 12.22,55.88 12.38,58.1 10.32,59.53 10.48,60.96 10.48,63.18 12.38,63.82 8.57,62.71 6.99,60.64 8.26,58.58 3.49,56.99 3.33,61.44 6.67,55.24 3.33,51.44 1.91,56.04 1.91,61.44 1.91,66.67 2.06,71.75 3.49,68.1 5.71,71.91 8.57,71.75 8.89,65.88 10,69.06 10.32,73.82 10.48,76.2 6.67,77.31 6.67,74.93 4.45,73.82 0.79,78.11 1.59,80.49 2.38,85.09 3.33,80.96 5.08,82.39 6.99,84.45 6.99,86.68 4.29,83.98 4.76,88.11 1.43,88.42 9.37,89.06 7.94,91.92 6.99,90.65 3.81,93.34 7.14,96.52 7.3,98.27 11.59,98.27 13.49,97 13.49,95.73 12.06,97.31 9.05,97.31 15.24,99.06 16.99,88.27 18.1,84.93 15.72,84.45 21.27,82.71 17.62,82.07 13.49,79.38 20.64,78.74 20.16,76.36 19.05,78.11 20,70.48 22.23,71.6 23.5,71.75 23.5,73.18 25.72,73.66 28.1,72.07 28.42,69.06 21.59,65.41 18.73,63.02 18.26,66.2 14.76,68.1 15.24,63.5 12.54,71.91 14.61,70.96 12.7,76.68 12.54,74.14 16.67,75.25 18.57,74.93 17.3,79.85 27.15,62.39 28.42,83.5 28.73,82.55 25.4,75.41 24.92,81.6 21.43,84.93 20.48,85.25 26.04,85.09
  pour Top: 0,99.85 29.53,100.01 29.53,0 0,0
  pour Bottom: 0,0 29.53,0 29.53,100.01 0,100.01
HSTH  (via drill 0.33)
  Top 0.254: v8.89,42.23 8.89,46.67 9.21,46.99 11.11,46.99 11.43,47.31 v11.43,48.26
  Bottom 0.254: T1.2 26.83,61.12 26.04,60.33 26.04,50.16 24.13,48.26 v11.43,48.26 10.79,48.9 10.79,49.7 C27.1 R44.1 | U2.A2 6.07,37.19 8.73,39.85 8.73,42.07 v8.89,42.23
IN-1
  Bottom 0.254: U3.5 9.84,89.85 9.68,90.01 R12.1
  Bottom 1.778: R12.1 9.69,95.27 C10.1 8.73,95.73 7.17,94.17 L1.P$2 5.08,91.73 C9.+
IS1O
  Bottom 0.254: U3.6 10.63,91.14 R9.1
ISNS_REF  (via drill 0.33)
  Top 0.254: v6.03,44.45 6.03,66.36 7.62,67.94 7.62,71.75 3.02,76.36 3.02,79.22 v4.45,80.64 | v15.72,86.36 15.72,90.33 v15.88,90.49
  Bottom 0.254: U3.1 13.3,90.5 C5.1 13.34,90.5 13.34,91.44 13.97,92.08 TP5.1 15.24,92.08 15.88,91.44 v15.88,90.49 | R3.1 11.57,39.37 R2.2 11.43,42.55 10.66,43.32 2.18,43.32 | 2.18,43.32 U2.A5 v6.03,44.45 | 2.18,43.32 C26.1 | v4.45,80.64 4.45,83.19 7.62,86.36 v15.72,86.36
N$3
  Bottom 0.254: R15.2 13.65,59.37 13.97,59.05 13.97,58.42 14.29,58.1 R19.2 14.85,57.87 U5.1
N$4
  Bottom 0.254: R14.2 13.34,52.39 13.97,53.02 13.98,53.02 R18.1 14.85,53.89 U5.3
N$10
  Bottom 1.778: Q5.2 25.72,67.63 23.45,69.89 F2.1
N$13
  Bottom 1.422: R6.1 26.5,77.24 J1.2
N$26
  Bottom 0.254: R38.2 17.46,49.57 U2.A12
N$32
  Bottom 1.016: Q4.8 18.64,12.45 18.57,12.38 | Q4.7 18.57,11.43 | Q4.6 18.57,10.16 | Q4.5 18.64,9.46 18.57,9.53 | 18.57,5.4 18.57,5.36 F1.A
  Bottom 2.54: 18.57,12.38 18.57,11.43 18.57,10.16 18.57,9.53 18.57,5.4
NGATE1  (via drill 0.33)
  Top 0.61: Q3.4 20,93.5 v19.68,93.82
  Bottom 0.61: R4.1 19.67,96.94 U1.5 v19.68,93.82
OA1+
  Bottom 0.254: J2.2 24.13,53.34 21.59,55.88 18.26,55.88 14.76,59.37 R15.1 14.61,59.37 R17.1
OA1-  (via drill 0.33)
  Top 0.254: v25.4,46.51 25.4,48.9 J2.1
  Bottom 0.254: R13.1 6.99,10.48 5.56,11.91 5.56,23.02 13.02,30.48 24.77,30.48 25.4,31.11 25.4,33.97 25.08,34.29 24.77,34.29 23.65,35.4 23.65,40.8 25.4,42.55 v25.4,46.51 | R14.1 14.92,52.39 15.56,53.02 19.68,53.02 22.54,50.16 J2.1
PB5  (via drill 0.33)
  Top 0.254: v22.07,19.21 20.8,19.21 19.68,20.32 19.68,23.5 18.73,24.45 14.29,24.45 12.7,26.04 12.7,36.35 14.45,38.1 v17.3,38.1
  Bottom 0.254: R35.1 v17.3,38.1 17.3,39.25 U2.B5 | JP1.3 22.86,6.99 22.23,7.62 22.23,13.18 22.07,13.34 v22.07,19.21
PB12
  Bottom 0.254: R34.1 17.3,69.73 U2.B12
PGATE1  (via drill 0.33)
  Top 0.61: v21.91,94.93 20.48,94.93 20.16,95.25 19.21,95.25 18.89,94.93 Q2.4
  Bottom 0.61: v21.91,94.93 23.18,94.93 23.5,95.25 U1.8 23.51,96.94 R5.2
Q7G
  Bottom 0.254: R40.1 24.3,72.53 Q5.1
SCL-TX  (via drill 0.33)
  Top 0.254: JP2.2 27.3,4.45 28.57,5.71 v28.57,22.23 | v26.67,22.38 v26.67,24.77 | v10.48,58.1 10.95,57.63 10.95,53.18 11.43,52.7 16.19,52.7 16.99,53.5 21.75,53.5 22.23,53.98 26.83,53.98 27.94,52.86 27.94,46.67 22.7,41.43 22.7,34.61 v27.94,29.37
  Bottom 0.254: v28.57,22.23 26.83,22.23 v26.67,22.38 | U2.B10 8.26,57.15 9.37,58.1 v10.48,58.1 | v27.94,29.37 27.94,26.04 v26.67,24.77
SDA-RX  (via drill 0.33)
  Top 0.254: v26.83,20.8 26.19,20.8 25.56,21.43 25.56,24.29 v24.45,25.4 | v7.62,44.93 7.62,42.23 v9.53,40.32 | v9.53,28.57 v11.11,26.99
  Bottom 0.254: JP2.3 26.67,6.99 27.94,8.26 27.94,16.19 28.57,16.83 28.57,20.64 28.42,20.8 v26.83,20.8 | U2.B11 2.18,56.87 3.17,55.88 7.3,55.88 8.73,54.45 8.73,45.24 8.41,44.93 v7.62,44.93 | v9.53,40.32 v9.53,28.57 | v11.11,26.99 11.11,26.51 12.06,25.56 14.29,25.56 14.61,25.88 18.89,25.88 20,24.77 23.81,24.77 v24.45,25.4
SW5V
  Bottom 0.254: C13.2 5.63,78.26 5.47,78.11
  Bottom 0.61: U4.6 5.47,78.11 5.47,79.5 L2.1 5.71,79.95 5.71,81.28 6.38,81.94 D4.K

### Text on the board
tPlace: C1A | Q2 | R9 | C10 | L1 | U3 | R12 | Q3 | C4 | + | J1 | + | Q5 | T1 | RS+ | RS- | R20 | NTC10k | LED1 | B5 | DO | RX | TX | 3V3 | 5V | GND
bPlace: R4 | R5 | C10 | U1 | R12 | C1 | D1 | C3 | REF | R9 | U3 | C5 | C2 | C16 | C9 | D4 | GND | L2 | R6 | R8 | C13 | R37 | C19 | R36 | C14 | 3A | C17 | C22 | R42 | U7 | R28 | C24 | VB | R7 | R21 | U4 | R23 | R39 | R22 | R29 | F2 | R40 | R34 | C18 | R24 | R34 | R26 | R15 | R19 | R52 | U5 | C7 | C12 | 2V495 | R14 | R18 | R44 | R16 | C28 | R38 | C27 | C15 | rev0.net | justin kenny 2020 | C26 | R3 | C11 | R2 | R43 | R35 | U9 | C25 | R33 | C20 | C21 | Q1 | R1 | R27 | Q4 | F1 | CCR Mini | R13 | R10 | R11
bStop: 7.5-12.5V | v2.5su